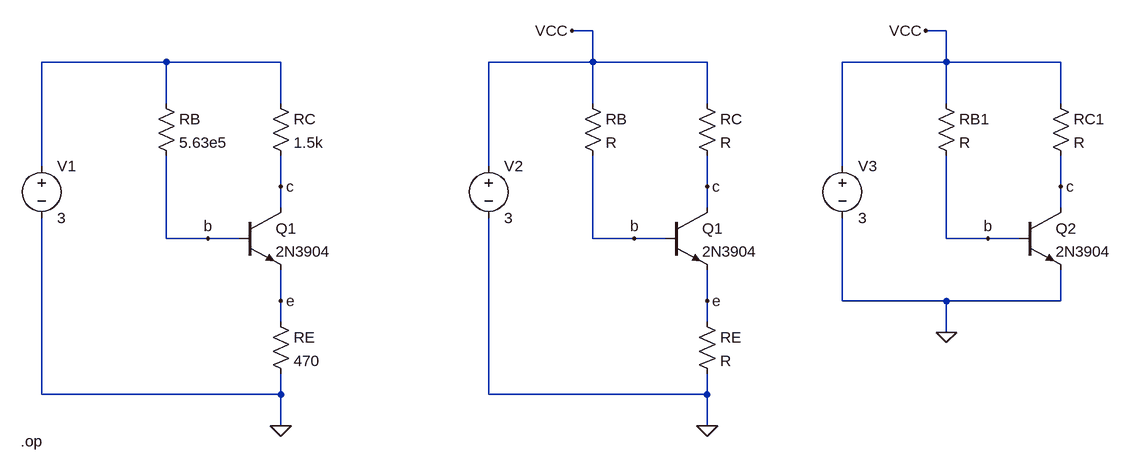
[diagram p0: schematic 02-Common_collector.asc]
02-Common_collector.asc, the LTspice schematic file:
Version 4
SHEET 1 1616 680
WIRE 816 0 784 0
WIRE 1360 0 1328 0
WIRE 160 48 -32 48
WIRE 336 48 160 48
WIRE 816 48 816 0
WIRE 816 48 656 48
WIRE 992 48 816 48
WIRE 1360 48 1360 0
WIRE 1360 48 1200 48
WIRE 1536 48 1360 48
WIRE 160 112 160 48
WIRE 336 112 336 48
WIRE 816 112 816 48
WIRE 992 112 992 48
WIRE 1360 112 1360 48
WIRE 1536 112 1536 48
WIRE -32 208 -32 48
WIRE 656 208 656 48
WIRE 1200 208 1200 48
WIRE 336 240 336 192
WIRE 992 240 992 192
WIRE 1536 240 1536 192
WIRE 336 272 336 240
WIRE 992 272 992 240
WIRE 1536 272 1536 240
WIRE 160 320 160 192
WIRE 224 320 160 320
WIRE 272 320 224 320
WIRE 816 320 816 192
WIRE 880 320 816 320
WIRE 928 320 880 320
WIRE 1360 320 1360 192
WIRE 1424 320 1360 320
WIRE 1472 320 1424 320
WIRE 336 416 336 368
WIRE 992 416 992 368
WIRE 1200 416 1200 288
WIRE 1360 416 1200 416
WIRE 1536 416 1536 368
WIRE 1536 416 1360 416
WIRE 336 448 336 416
WIRE 992 448 992 416
WIRE 1360 464 1360 416
WIRE -32 560 -32 288
WIRE 336 560 336 528
WIRE 336 560 -32 560
WIRE 656 560 656 288
WIRE 992 560 992 528
WIRE 992 560 656 560
WIRE 336 608 336 560
WIRE 992 608 992 560
FLAG 336 416 e
FLAG 336 240 c
FLAG 336 608 0
FLAG 224 320 b
FLAG 992 416 e
FLAG 992 240 c
FLAG 992 608 0
FLAG 880 320 b
FLAG 784 0 VCC
FLAG 1536 240 c
FLAG 1360 464 0
FLAG 1424 320 b
FLAG 1328 0 VCC
SYMBOL voltage -32 192 R0
WINDOW 123 0 0 Left 0
WINDOW 39 0 0 Left 0
SYMATTR InstName V1
SYMATTR Value 3
SYMBOL res 320 96 R0
SYMATTR InstName RC
SYMATTR Value 1.5k
SYMBOL npn 272 272 R0
SYMATTR InstName Q1
SYMATTR Value 2N3904
SYMBOL res 320 432 R0
SYMATTR InstName RE
SYMATTR Value 470
SYMBOL res 144 96 R0
SYMATTR InstName RB
SYMATTR Value 5.63e5
SYMBOL voltage 656 192 R0
WINDOW 123 0 0 Left 0
WINDOW 39 0 0 Left 0
SYMATTR InstName V2
SYMATTR Value 3
SYMBOL res 976 96 R0
SYMATTR InstName RC
SYMBOL npn 928 272 R0
SYMATTR InstName Q1
SYMATTR Value 2N3904
SYMBOL res 976 432 R0
SYMATTR InstName RE
SYMBOL res 800 96 R0
SYMATTR InstName RB
SYMBOL voltage 1200 192 R0
WINDOW 123 0 0 Left 0
WINDOW 39 0 0 Left 0
SYMATTR InstName V3
SYMATTR Value 3
SYMBOL res 1520 96 R0
SYMATTR InstName RC1
SYMBOL npn 1472 272 R0
SYMATTR InstName Q2
SYMATTR Value 2N3904
SYMBOL res 1344 96 R0
SYMATTR InstName RB1
TEXT -64 632 Left 2 !.op

The netlist it stands for:
* 02-Common_collector.asc
V1 N001 0 3
RC N001 c 1.5k
Q1 c b e 0 2N3904
RE e 0 470
RB N001 b 5.63e5
V2 VCC 0 3
RC VCC c R
Q1 c b e 0 2N3904
RE e 0 R
RB VCC b R
V3 VCC 0 3
RC1 VCC c R
Q2 c b 0 0 2N3904
RB1 VCC b R
.model NPN NPN
.model PNP PNP
.lib standard.bjt
.op
.backanno
.end